# Altium schematic sheet IMU.SchDoc
size A4
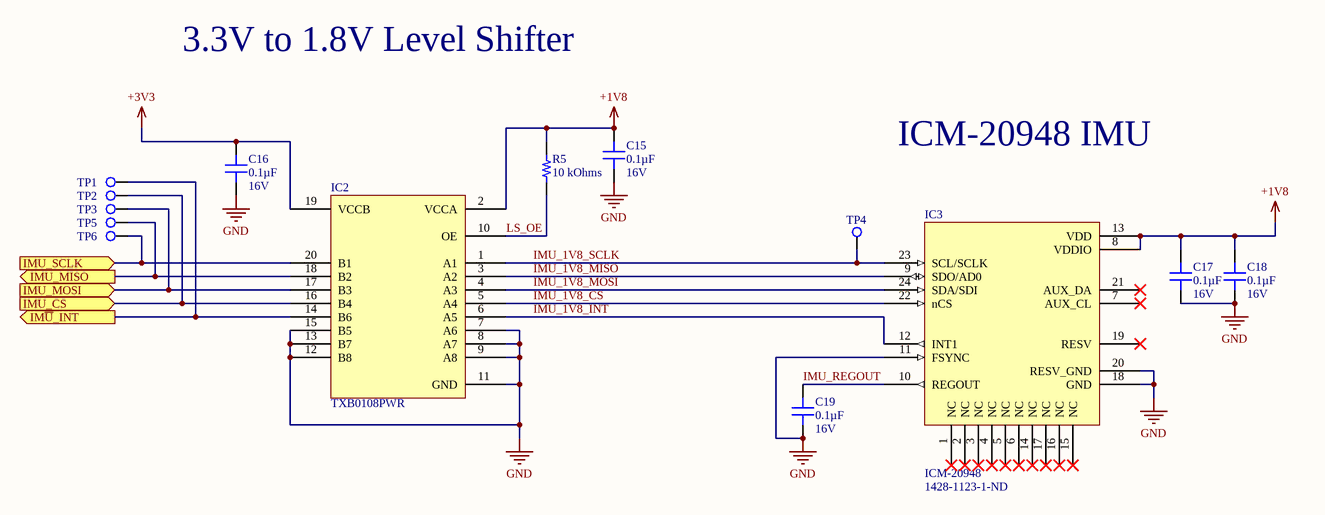
[diagram p0: IMU.SchDoc]

## Parts
C15  Voltage - Rated: 16V  [CAP 0603_1608]  (hidden comment: 0.1µF)
C16  Voltage - Rated: 16V  [CAP 0603_1608]  (hidden comment: 0.1µF)
C17  Voltage - Rated: 16V  [CAP 0603_1608]  (hidden comment: 0.1µF)
C18  Voltage - Rated: 16V  [CAP 0603_1608]  (hidden comment: 0.1µF)
C19  Voltage - Rated: 16V  [CAP 0603_1608]  (hidden comment: 0.1µF)
IC2  TXB0108PWR  [TI TSSOP-20 PW]
IC3  ICM-20948  Supplier Part Number 1: 1428-1123-1-ND  [ICM-20948]
R5  10 kOhms  [RES 0603_1608]
TP1  TestPoint  [TestPoint]  (value not drawn)  (no BOM)
TP2  TestPoint  [TestPoint]  (value not drawn)  (no BOM)
TP3  TestPoint  [TestPoint]  (value not drawn)  (no BOM)
TP4  TestPoint  [TestPoint]  (value not drawn)  (no BOM)
TP5  TestPoint  [TestPoint]  (value not drawn)  (no BOM)
TP6  TestPoint  [TestPoint]  (value not drawn)  (no BOM)

## Ports
IMU_CS (in), IMU_MISO (out), IMU_MOSI (in), IMU_SCLK (in), IM~{U}_INT (out)

## Nets
+1V8: C15.1 C17.2 C18.2 IC2.2(VCCA) IC3.8(VDDIO) IC3.13(VDD) R5.1
+3V3: C16.2 IC2.19(VCCB)
GND: C15.2 C16.1 C17.1 C18.1 C19.1 IC2.7(A6) IC2.8(A7) IC2.9(A8) IC2.11(GND) IC2.12(B8) IC2.13(B7) IC2.15(B5) IC3.11(FSYNC) IC3.18(GND) IC3.20(RESV_GND)
IM~{U}_INT: IC2.14(B6) TP1.1 ; port IM~{U}_INT
IMU_1V8_CS: IC2.5(A4) IC3.22(nCS)
IMU_1V8_INT: IC2.6(A5) IC3.12(INT1)
IMU_1V8_MISO: IC2.3(A2) IC3.9(SDO/AD0)
IMU_1V8_MOSI: IC2.4(A3) IC3.24(SDA/SDI)
IMU_1V8_SCLK: IC2.1(A1) IC3.23(SCL/SCLK) TP4.1
IMU_CS: IC2.16(B4) TP2.1 ; port IMU_CS
IMU_MISO: IC2.18(B2) TP5.1 ; port IMU_MISO
IMU_MOSI: IC2.17(B3) TP3.1 ; port IMU_MOSI
IMU_REGOUT: C19.2 IC3.10(REGOUT)
IMU_SCLK: IC2.20(B1) TP6.1 ; port IMU_SCLK
LS_OE: IC2.10(OE) R5.2

Not connected (* = marked no-connect by the designer): IC3 1(NC)* 2(NC)* 3(NC)* 4(NC)* 5(NC)* 6(NC)* 7(AUX_CL)* 14(NC)* 15(NC)* 16(NC)* 17(NC)* 19(RESV)* 21(AUX_DA)*

## Notes on the sheet
- 3.3V to 1.8V Level Shifter
- ICM-20948 IMU

## Library data of the parts
C15-C19 = CC0603KRX7R7BB104: CAP CER 0.1UF 16V X7R 0603; Manufacturer: Yageo; Tolerance: ±10%; Part Number: CC0603KRX7R7BB104; Value: 0.1µF; Applications: General Purpose; Capacitance: 0.1µF; ComponentLink1Description: Datasheet; ComponentLink1URL: https://www.yageo.com/upload/media/product/productsearch/datasheet/mlcc/UPY-GPHC_X7R_6.3V-to-50V_18.pdf; ComponentLink2Description: DigiKey Link; ComponentLink2URL: http://digikey.com/product-detail/en/yageo/CC0603KRX7R7BB104/311-1088-1-ND/302998; Device Package: 0603 (1608 Metric); LastUpdated: 9/2/2020 1:03:05 AM; Lifecycle Status: Active; Minimum Order: 1; Mounting Type: Surface Mount, MLCC; Operating Temperature: -55°C ~ 125°C; Package / Case: 0603 (1608 Metric); Packaging: TapeAndReel; PartId: 16746; Part Status: Active; Price: 0.01; Series: CC; Size / Dimension: 0.063" L x 0.031" W (1.60mm x 0.80mm); Supplier 1: DigiKey; Supplier Part Number 1: 311-1088-1-ND; Temperature Coefficient: X7R; Thickness (Max): 0.035" (0.90mm)
IC2 = TXB0108PWR: IC TRNSLTR BIDIRECTIONAL 20TSSOP; Manufacturer: Texas Instruments; Channels per Circuit: 8; Data Rate: 100Mbps; Number of Circuits: 1; Output Type: Tri-State, Non-Inverted; Translator Type: Voltage Level; Voltage - VCCA: 1.2V ~ 3.6V; Voltage - VCCB: 1.65V ~ 5.5V; Part Number: TXB0108PWR; Channel Type: Bidirectional; ComponentLink1Description: Datasheet; ComponentLink1URL: http://www.ti.com/general/docs/suppproductinfo.tsp?distId=10&gotoUrl=http%3A%2F%2Fwww.ti.com%2Flit%2Fgpn%2Ftxb0108; ComponentLink2Description: DigiKey Link; ComponentLink2URL: http://digikey.com/product-detail/en/texas-instruments/TXB0108PWR/296-21527-1-ND/1305700; Device Package: 20-TSSOP (0.173", 4.40mm Width); Features: Auto-Direction Sensing; LastUpdated: 3/30/2020 4:25:06 PM; Lifecycle Status: Active; Minimum Order: 1; Mounting Type: Surface Mount; Operating Temperature: -40°C ~ 85°C (TA); Package / Case: 20-TSSOP (0.173", 4.40mm Width); Packaging: TapeAndReel; Part Status: Active; Price: 0.69; Series: -; Supplier 1: DigiKey; Supplier Part Number 1: 296-21527-1-ND; Supplier Device Package: 20-TSSOP
IC3 = ICM-20948: Accelerometer, Gyroscope, Magnetometer, 9 Axis Sensor I²C, SPI Output; Vendor: InvenSense; SourceLibrary: InvenSense_2020-09-29; Datasheet: https://invensense.tdk.com/wp-content/uploads/2016/06/DS-000189-ICM-20948-v1.3.pdf?ref_disty=digikey; Manufacturer_Part_Number: ICM-20948; Copyright: Copyright (C) 2018 Accelerated Designs. All rights reserved; RefDes: RefDes; Type: DEV; Supplier 1: Digi-Key
R5 = AC0603FR-0710KL: RES SMD 10K OHM 1% 1/10W 0603; Manufacturer: Yageo; Power (Watts): 0.1W, 1/10W; Temperature Coefficient: ±100ppm/°C; Part Number: AC0603FR-0710KL; Value: 10 kOhms; ComponentLink1Description: Datasheet; ComponentLink1URL: https://www.yageo.com/upload/media/product/productsearch/datasheet/rchip/PYu-AC_51_RoHS_L_7.pdf; ComponentLink2Description: DigiKey Link; ComponentLink2URL: http://digikey.com/product-detail/en/yageo/AC0603FR-0710KL/311-10KLDCT-ND/2828135; Composition: Thick Film; Device Package: 0603 (1608 Metric); Features: Automotive AEC-Q200, Moisture Resistant; Height - Seated (Max): 0.022" (0.55mm); LastUpdated: 9/2/2020 1:09:58 AM; Lifecycle Status: Active; Minimum Order: 1; Number of Terminations: 2; Operating Temperature: -55°C ~ 155°C; Package / Case: 0603 (1608 Metric); Packaging: CutTape; PartId: 17347; Part Status: Active; Price: 0.10; Ratings: AEC-Q200; Resistance: 10 kOhms; Series: AC; Size / Dimension: 0.063" L x 0.031" W (1.60mm x 0.80mm); Supplier 1: DigiKey; Supplier Part Number 1: 311-10KLDCT-ND; Supplier Device Package: 0603; Tolerance: ±1%